# Altium schematic sheet USB DAC Block Diagram.SchDoc
size B
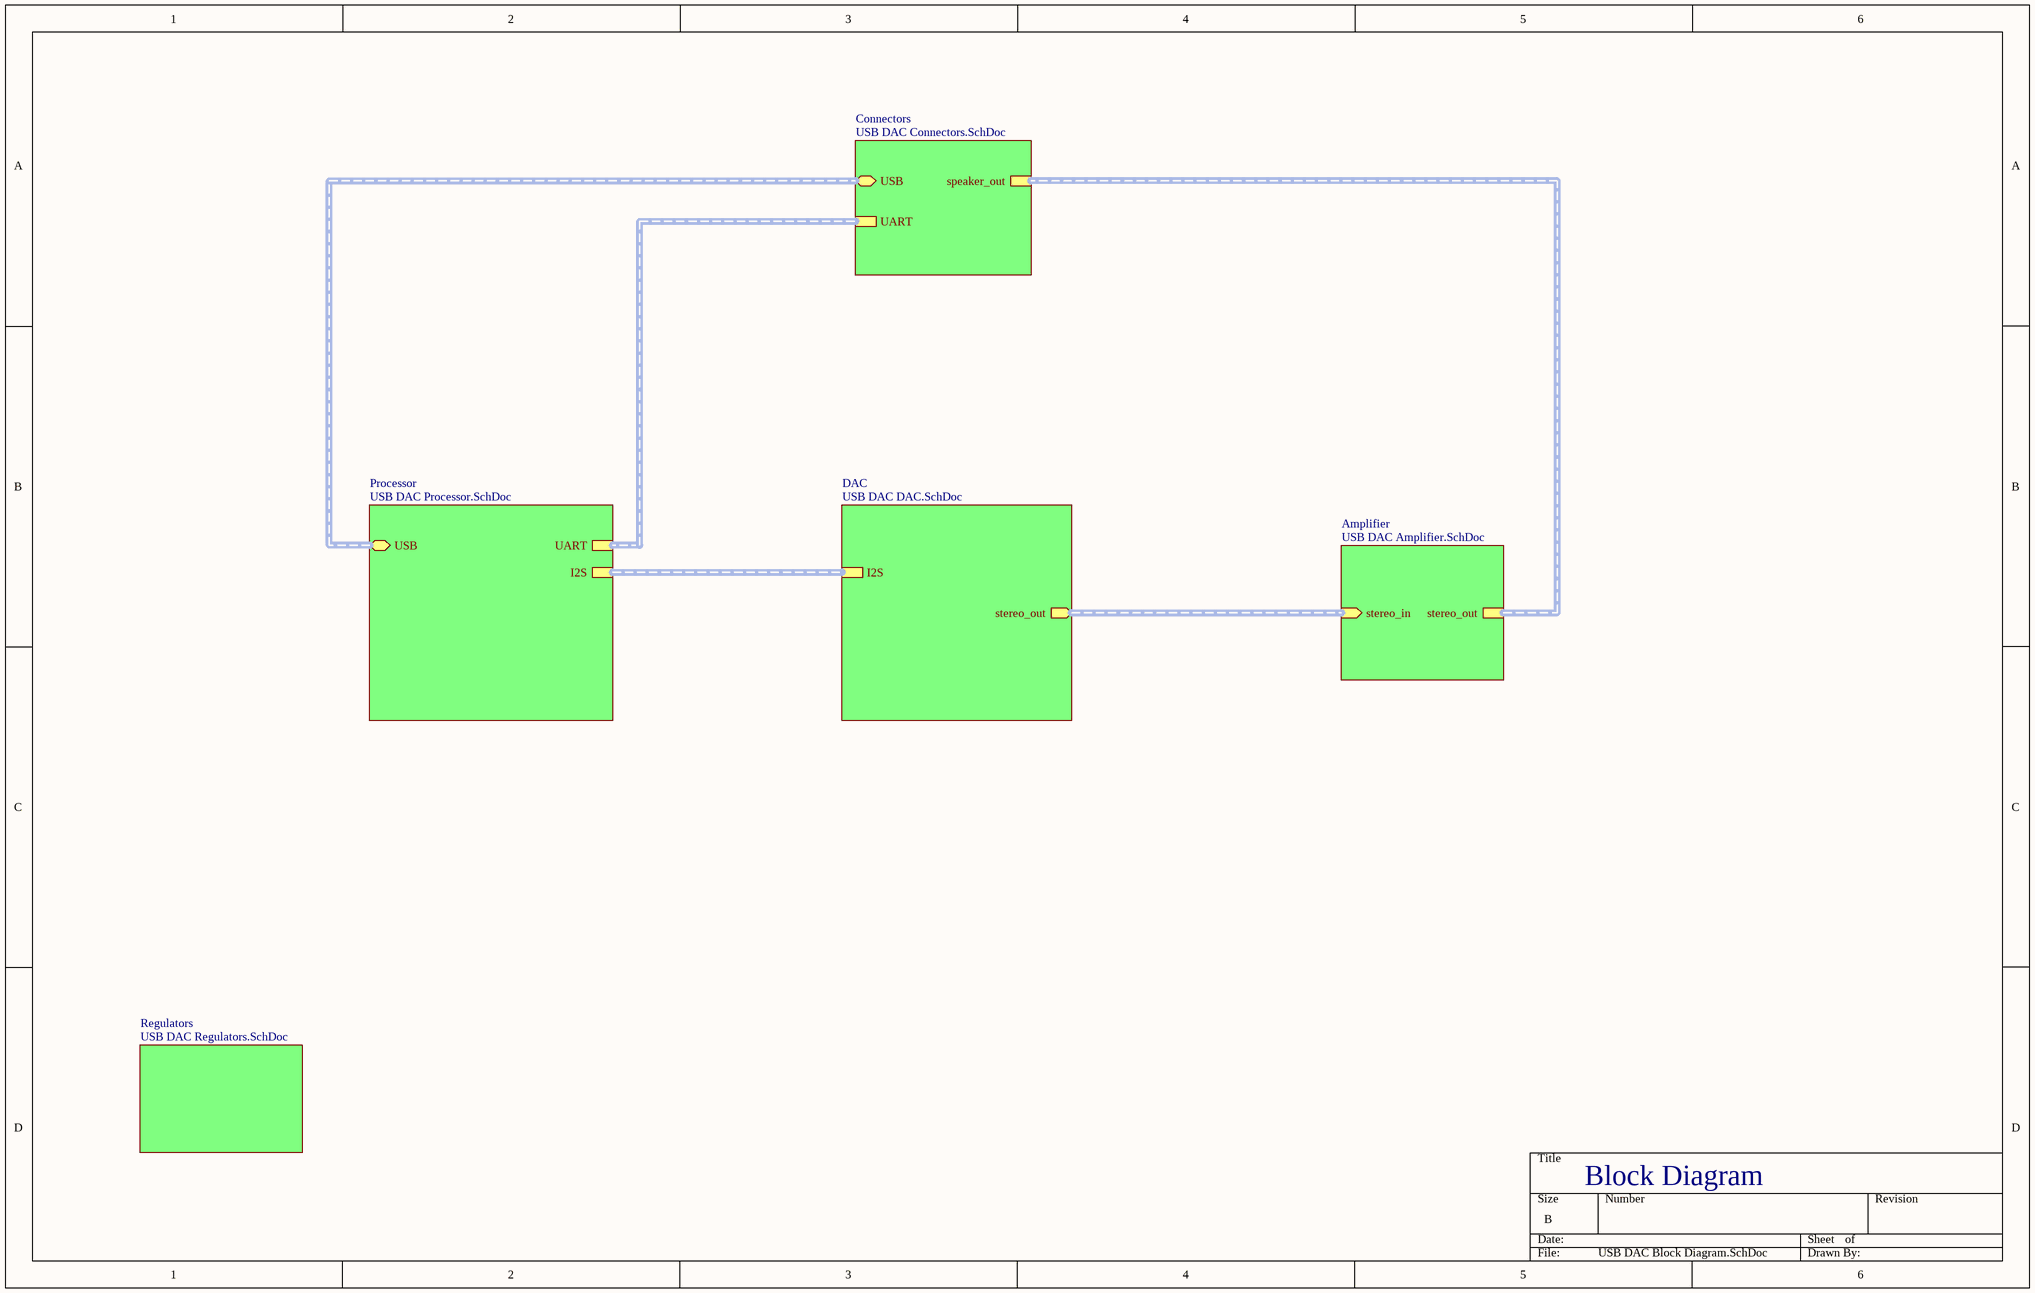
[diagram p0: USB DAC Block Diagram.SchDoc]

## Sub-sheets
Amplifier = USB DAC Amplifier.SchDoc: stereo_in (in), stereo_out
Connectors = USB DAC Connectors.SchDoc: USB (bidir), speaker_out, UART
DAC = USB DAC DAC.SchDoc: stereo_out (out), I2S
Processor = USB DAC Processor.SchDoc: USB (bidir), I2S, UART (harness UART)
Regulators = USB DAC Regulators.SchDoc: no entries

## Buses and harness runs
harness sheet Amplifier/stereo_in = sheet DAC/stereo_out
harness sheet Amplifier/stereo_out = sheet Connectors/speaker_out
harness sheet Connectors/UART = sheet Processor/UART
harness sheet Connectors/USB = sheet Processor/USB
harness sheet DAC/I2S = sheet Processor/I2S

## Notes on the sheet
- Block Diagram